# Altium schematic sheet 06_H3ETHERNET.SchDoc
size A3
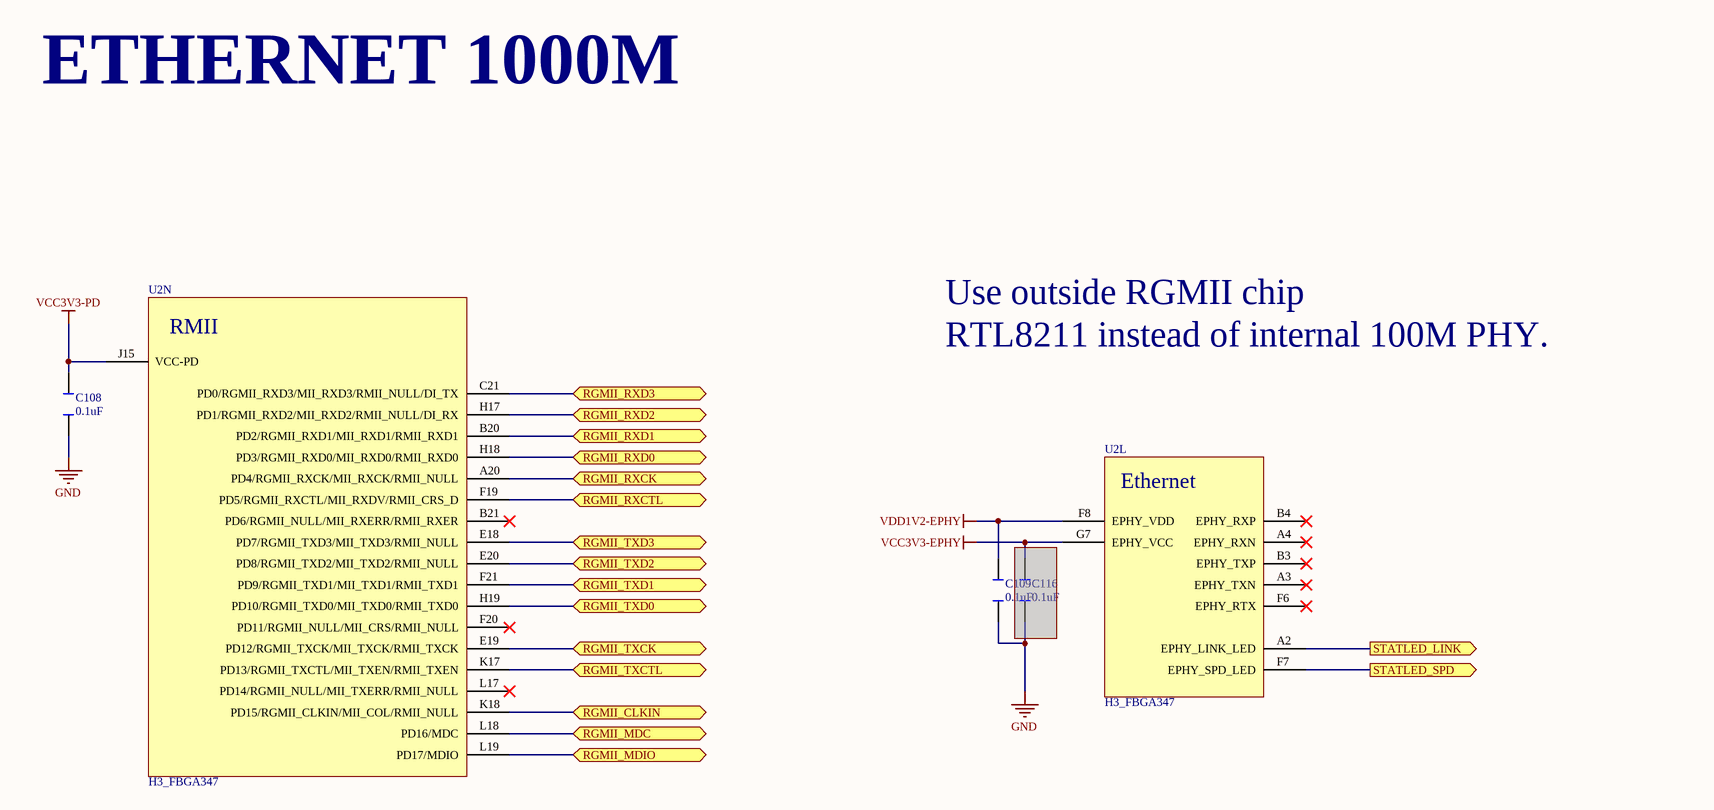
[diagram p0: 06_H3ETHERNET.SchDoc]

## Parts
C108  0.1uF  [C0402]
C109  0.1uF  [C0402]
C116  0.1uF  [C0402]  (masked out: inside a compile mask, not in the netlist)
U2  H3_FBGA347  [H3_FBGA327]  (parts L,N of 16)

## Ports
RGMII_CLKIN (bidir), RGMII_MDC (bidir), RGMII_MDIO (bidir), RGMII_RXCK (bidir), RGMII_RXCTL (bidir), RGMII_RXD0 (bidir), RGMII_RXD1 (bidir), RGMII_RXD2 (bidir), RGMII_RXD3 (bidir), RGMII_TXCK (bidir), RGMII_TXCTL (bidir), RGMII_TXD0 (bidir), RGMII_TXD1 (bidir), RGMII_TXD2 (bidir), RGMII_TXD3 (bidir), STATLED_LINK (out), STATLED_SPD (out)

## Nets
GND: C108.1 C109.1
VCC3V3-EPHY: U2.G7(EPHY_VCC)
VCC3V3-PD: C108.2 U2.J15(VCC-PD)
VDD1V2-EPHY: C109.2 U2.F8(EPHY_VDD)
RGMII_CLKIN: U2.K18(PD15/RGMII_CLKIN/MII_COL/RMII_NULL) ; port RGMII_CLKIN
RGMII_MDC: U2.L18(PD16/MDC) ; port RGMII_MDC
RGMII_MDIO: U2.L19(PD17/MDIO) ; port RGMII_MDIO
RGMII_RXCK: U2.A20(PD4/RGMII_RXCK/MII_RXCK/RMII_NULL) ; port RGMII_RXCK
RGMII_RXCTL: U2.F19(PD5/RGMII_RXCTL/MII_RXDV/RMII_CRS_D) ; port RGMII_RXCTL
RGMII_RXD0: U2.H18(PD3/RGMII_RXD0/MII_RXD0/RMII_RXD0) ; port RGMII_RXD0
RGMII_RXD1: U2.B20(PD2/RGMII_RXD1/MII_RXD1/RMII_RXD1) ; port RGMII_RXD1
RGMII_RXD2: U2.H17(PD1/RGMII_RXD2/MII_RXD2/RMII_NULL/DI_RX) ; port RGMII_RXD2
RGMII_RXD3: U2.C21(PD0/RGMII_RXD3/MII_RXD3/RMII_NULL/DI_TX) ; port RGMII_RXD3
RGMII_TXCK: U2.E19(PD12/RGMII_TXCK/MII_TXCK/RMII_TXCK) ; port RGMII_TXCK
RGMII_TXCTL: U2.K17(PD13/RGMII_TXCTL/MII_TXEN/RMII_TXEN) ; port RGMII_TXCTL
RGMII_TXD0: U2.H19(PD10/RGMII_TXD0/MII_TXD0/RMII_TXD0) ; port RGMII_TXD0
RGMII_TXD1: U2.F21(PD9/RGMII_TXD1/MII_TXD1/RMII_TXD1) ; port RGMII_TXD1
RGMII_TXD2: U2.E20(PD8/RGMII_TXD2/MII_TXD2/RMII_NULL) ; port RGMII_TXD2
RGMII_TXD3: U2.E18(PD7/RGMII_TXD3/MII_TXD3/RMII_NULL) ; port RGMII_TXD3
STATLED_LINK: U2.A2(EPHY_LINK_LED) ; port STATLED_LINK
STATLED_SPD: U2.F7(EPHY_SPD_LED) ; port STATLED_SPD

Not connected (* = marked no-connect by the designer): U2 A3(EPHY_TXN)* A4(EPHY_RXN)* B3(EPHY_TXP)* B4(EPHY_RXP)* B21(PD6/RGMII_NULL/MII_RXERR/RMII_RXER)* F6(EPHY_RTX)* F20(PD11/RGMII_NULL/MII_CRS/RMII_NULL)* L17(PD14/RGMII_NULL/MII_TXERR/RMII_NULL)*

## Notes on the sheet
- ETHERNET 1000M
- Use outside RGMII chip
- RTL8211 instead of internal 100M PHY.
- (in symbol H3_FBGA347, part L) Ethernet
- (in symbol H3_FBGA347, part N) RMII

## Library data of the parts
C108 C109 C116 = C_0.1UF